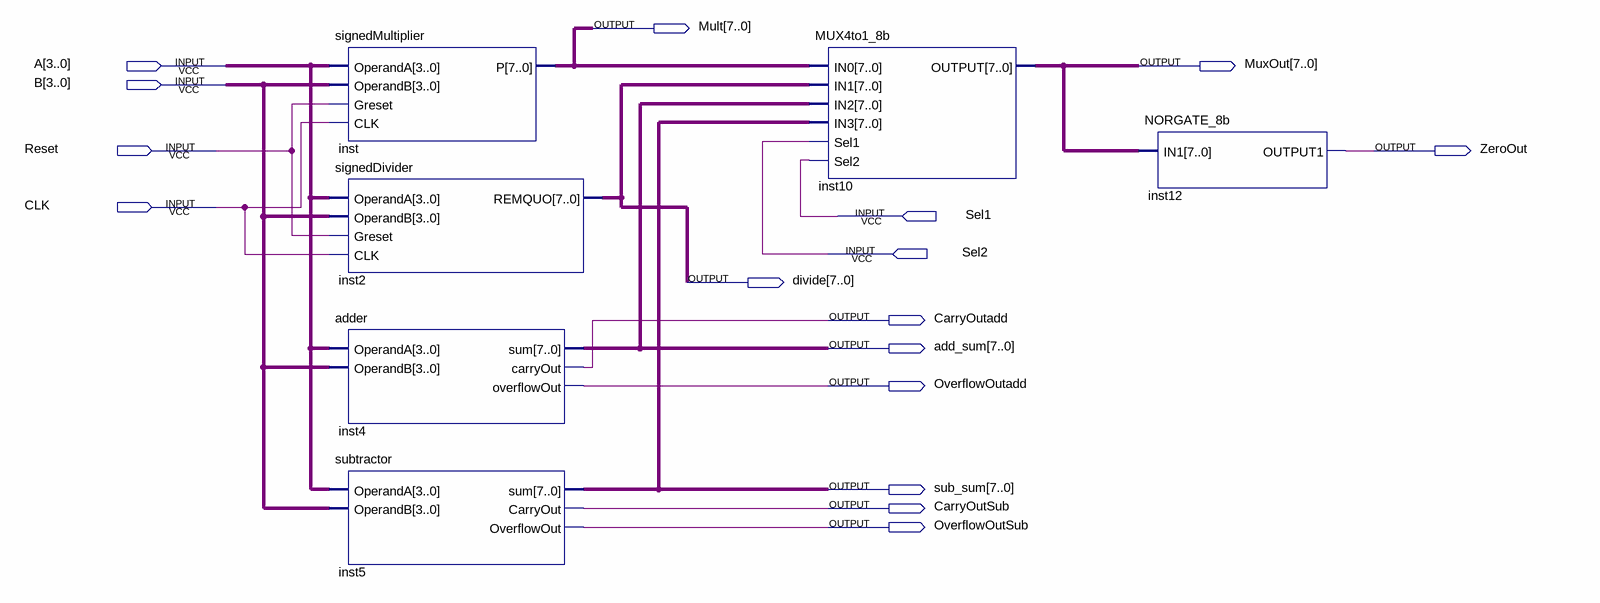
[diagram p0: schematic sheet]
// Quartus schematic top.bdf as structural Verilog: 6 symbols, 16 pins
module top (
  input  [3:0] A,
  input  [3:0] B,
  input  Reset,
  input  CLK,
  input  Sel1,
  input  Sel2,
  output [7:0] Mult,
  output [7:0] MuxOut,
  output ZeroOut,
  output [7:0] divide,
  output CarryOutadd,
  output [7:0] add_sum,
  output OverflowOutadd,
  output [7:0] sub_sum,
  output CarryOutSub,
  output OverflowOutSub
);

  signedMultiplier inst (.OperandA(A), .OperandB(B), .Greset(Reset), .CLK(CLK), .P(Mult));
  signedDivider inst2 (.OperandA(A), .OperandB(B), .Greset(Reset), .CLK(CLK), .REMQUO(divide));
  adder inst4 (.OperandA(A), .OperandB(B), .sum(add_sum), .carryOut(CarryOutadd), .overflowOut(OverflowOutadd));
  subtractor inst5 (.OperandA(A), .OperandB(B), .sum(sub_sum), .CarryOut(CarryOutSub), .OverflowOut(OverflowOutSub));
  MUX4to1_8b inst10 (.IN0(Mult), .IN1(divide), .IN2(add_sum), .IN3(sub_sum), .Sel1(Sel2), .Sel2(Sel1), .OUTPUT(MuxOut));
  NORGATE_8b inst12 (.IN1(MuxOut), .OUTPUT1(ZeroOut));
endmodule
